# EAGLE design Front Node_Terminal Blocks (EAGLE 7.4.0)
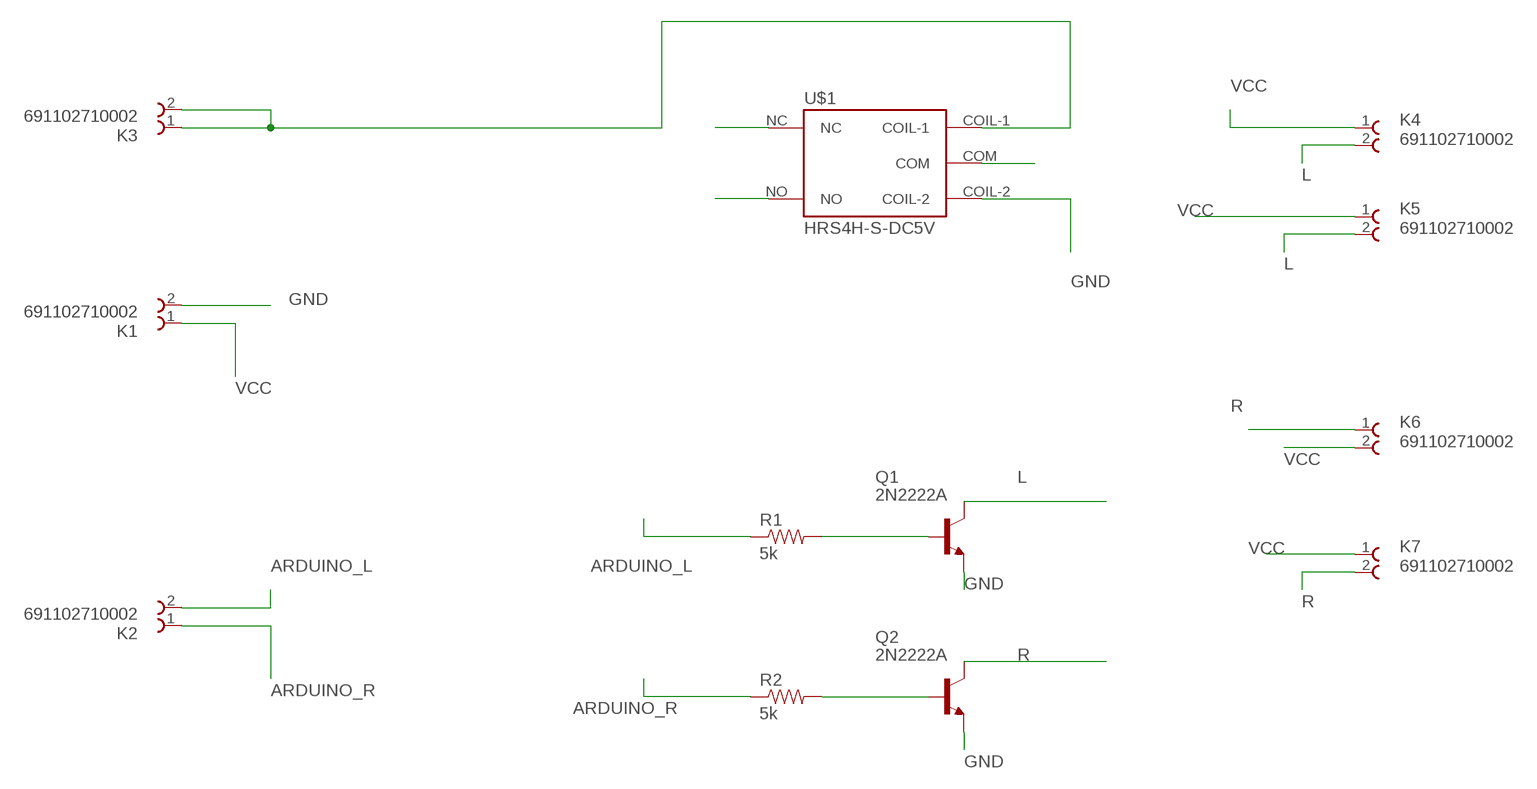
[diagram p0: schematic, sheet 1]

## Parts
K1  691102710002  [691102710002]
K2  691102710002  [691102710002]
K3  691102710002  [691102710002]
K4  691102710002  [691102710002]
K5  691102710002  [691102710002]
K6  691102710002  [691102710002]
K7  691102710002  [691102710002]
Q1  2N2222A  [TO18]
Q2  2N2222A  [TO18]
R1  5k  RESISTORPTH-1/4W  [AXIAL-0.4]
R2  5k  RESISTORPTH-1/4W  [AXIAL-0.4]
U$1  HRS4H-S-DC5V  [RELAY]

## Nets
ARDUINO_L: K2.2 R1.P$1
ARDUINO_R: K2.1 R2.P$1
COM: U$1.COM
GND: K1.2 Q1.1(E) Q2.1(E) U$1.COIL-2
L: K4.2 K5.2 Q1.3(C)
N$7: Q2.2(B) R2.P$2
N$8: Q1.2(B) R1.P$2
NC: U$1.NC
NO: U$1.NO
R: K6.1 K7.2 Q2.3(C)
SWITCH: K3.1 K3.2 U$1.COIL-1
VCC: K1.1 K4.1 K5.1 K6.2 K7.1

## Library data of the parts
K1-K7 = Wurth_Elektronik_Electromechanic_Terminal_Blocks_Connectors_rev15d:691102710002: WR-TBL Serie 102 - 5.0mm Horizontal Entry Modular with Pressure Clamp - 1.5mm2 Wires, 2 Pins=>Code : Con_TBL_Screw_PressureClamp_691102710002 <http://katalog.we-online.de/media/images/eican/Con_TBL_Screw_PressureClamp_6911027100xx_pf2.jpg> Details see: http://katalog.we-online.de/en/em/691_102_710_0xx Created 2014-06-17, Karrer Zheng 2014 (C) Würth Elektronik
Q1 Q2 = transistor-npn:2N2222*: NPN Transistor
R1 R2 = SparkFun-Resistors:RESISTOR: Resistor Basic schematic elements and footprints for 0603, 1206, and PTH resistors.
U$1 = Hooman:HRS4H-S-DC5V

## Board
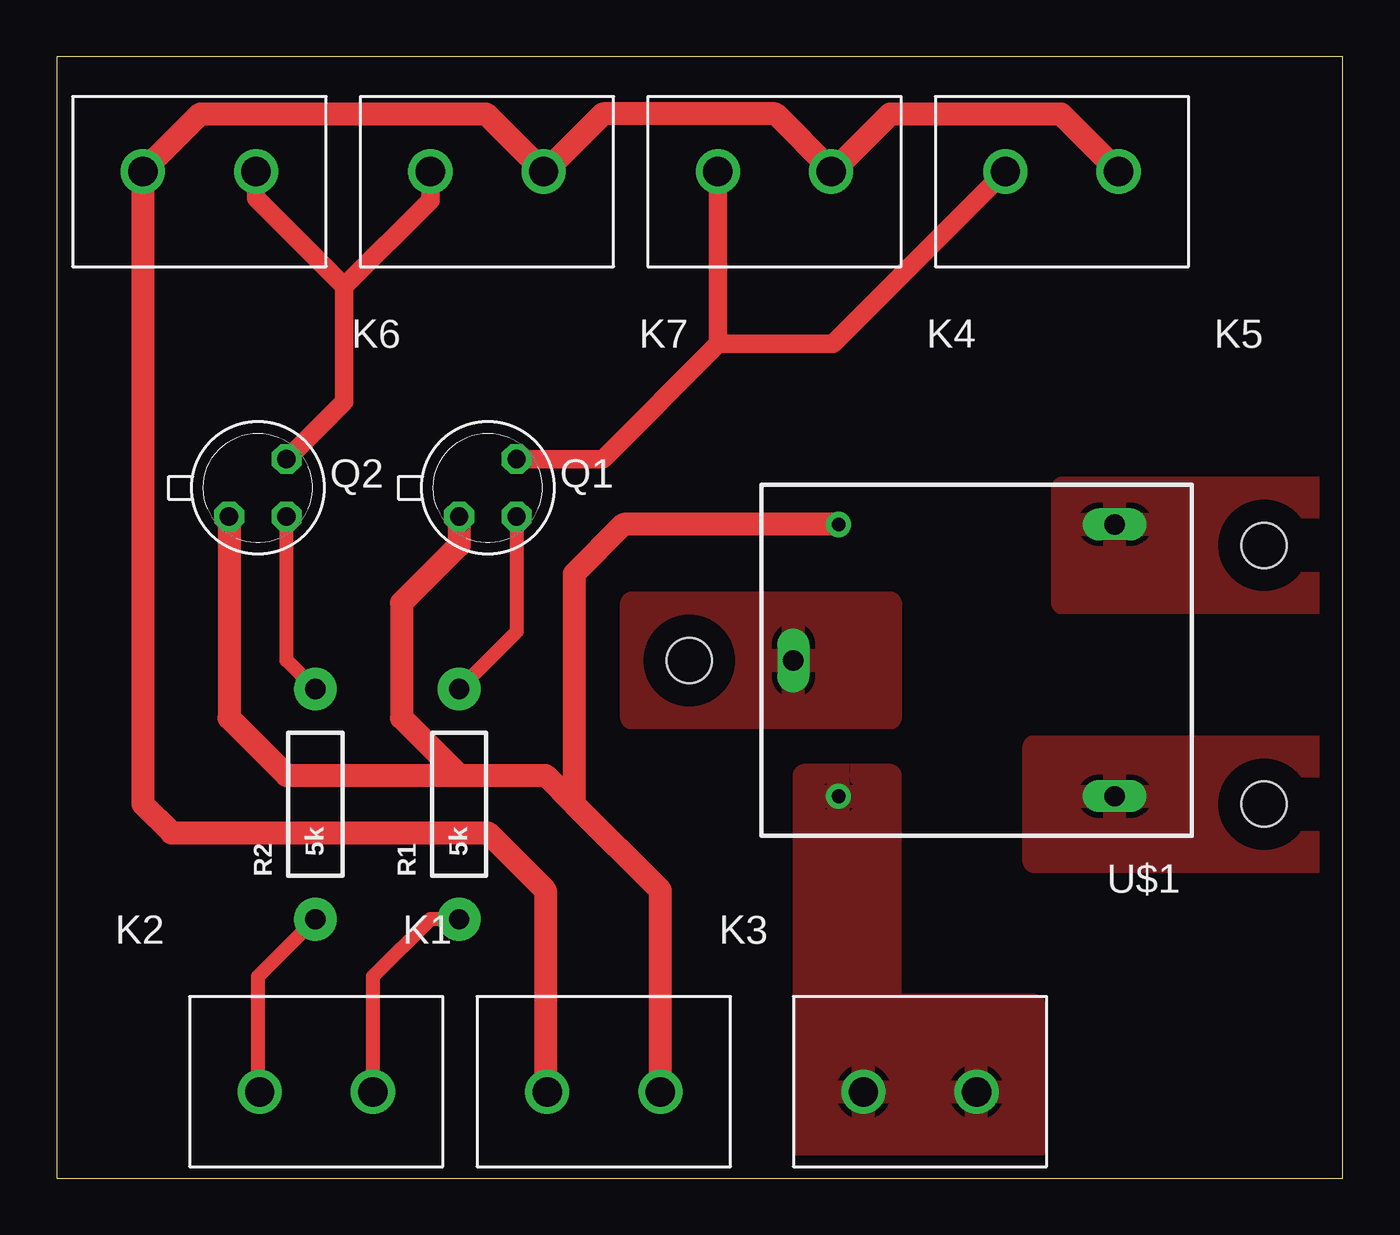
[diagram p1: board, top side]

Size 56.82 x 49.52 mm. Coordinates in mm from the lower left corner, seen from the top.
Outline: 0,0 56.82,0 56.82,49.52 0,49.52 0,0
Copper layers (1*16): Top 0.035mm / dielectric 1.5mm / Bottom 0.035mm
Design rules "default": minimum track width 10mil, minimum drill 24mil, track to track 8mil, track to pad 8mil, pad to pad 8mil, via to via 8mil, smd to smd 8mil, copper to edge 40mil, drill to drill 8mil, minimum pad ring 10mil, minimum via ring 8mil, stop-mask expansion 4mil, vias tented up to drill 0mil, thermal gap 10mil
Holes 2 mm at 27.94,22.86 53.34,27.94 53.34,16.51

### Footprints (pad centres in the part's own frame; a part is rotated, then mirrored left to right if it is on the bottom)
691102710002 = drill 1.3: 1 -5,0; 2 0,0
TO18 = drill 0.813 octagon: 1 -1.27,-1.27; 2 1.27,-1.27; 3 1.27,1.27
AXIAL-0.4 = drill 0.9 pad 1.88: P$1 -5.08,0; P$2 5.08,0
RELAY = drill 0.6: COIL-1 6.1,6; COIL-2 6.1,-6 | drill 0.9 long: COM 8.1,0; NC -6.1,6; NO -6.1,-6

### Placement (x,y rotation side)
K1  26.67,3.81 0 top
K2  13.97,3.81 0 top
K3  40.64,3.81 0 top
K4  29.21,44.45 180 top
K5  41.91,44.45 180 top
K6  3.81,44.45 180 top
K7  16.51,44.45 180 top
Q1  19.05,30.48 0 top
Q2  8.89,30.48 0 top
R1  17.78,16.51 90 top
R2  11.43,16.51 90 top
U$1  40.64,22.86 180 top

### Tracks (layer width: path | path; a pad name or v marks a point on that pad's centre or on a via)
ARDUINO_L
  Top 0.61: R1.P$1 16.51,11.43 13.97,8.89 K2.2
ARDUINO_R
  Top 0.61: R2.P$1 8.89,8.89 8.89,3.89 K2.1
COM
  pour Top: 25.4,25.4 36.83,25.4 36.83,20.32 25.4,20.32
GND
  Top 1.016: Q2.1 7.62,20.32 10.16,17.78 17.78,17.78 | 17.78,17.78 21.59,17.78 22.86,16.51 | K1.2 26.67,12.7 22.86,16.51 | Q1.1 17.78,27.94 15.24,25.4 15.24,20.32 17.78,17.78 | U$1.COIL-2 25.05,28.86 22.86,26.67 22.86,16.51
L
  Top 0.813: K4.2 29.21,36.83 | 29.21,36.83 24.13,31.75 Q1.3 | K5.2 34.29,36.83 29.21,36.83
N$7
  Top 0.61: R2.P$2 10.16,22.86 Q2.2
N$8
  Top 0.61: Q1.2 20.32,24.13 R1.P$2
NC
  pour Top: 57.15,19.05 57.15,13.97 43.18,13.97 43.18,19.05
NO
  pour Top: 44.45,30.48 57.15,30.48 57.15,25.4 44.45,25.4
R
  Top 0.813: Q2.3 12.7,34.29 12.7,39.37 | 12.7,39.37 16.51,43.18 K7.2 | 12.7,39.37 8.81,43.26 K6.1
SWITCH
  pour Top: 33.02,17.78 33.02,1.27 43.18,1.27 43.18,7.62 36.83,7.62 36.83,17.78
VCC
  Top 1.016: K5.1 44.37,46.99 36.83,46.99 34.29,44.45 K4.1 34.21,44.53 31.75,46.99 24.13,46.99 21.59,44.45 K7.1 18.97,46.99 6.35,46.99 K6.2 3.81,16.51 5.08,15.24 19.05,15.24 21.59,12.7 21.59,3.89 K1.1